# Altium schematic sheet GLOBAL.SchDoc
size A4
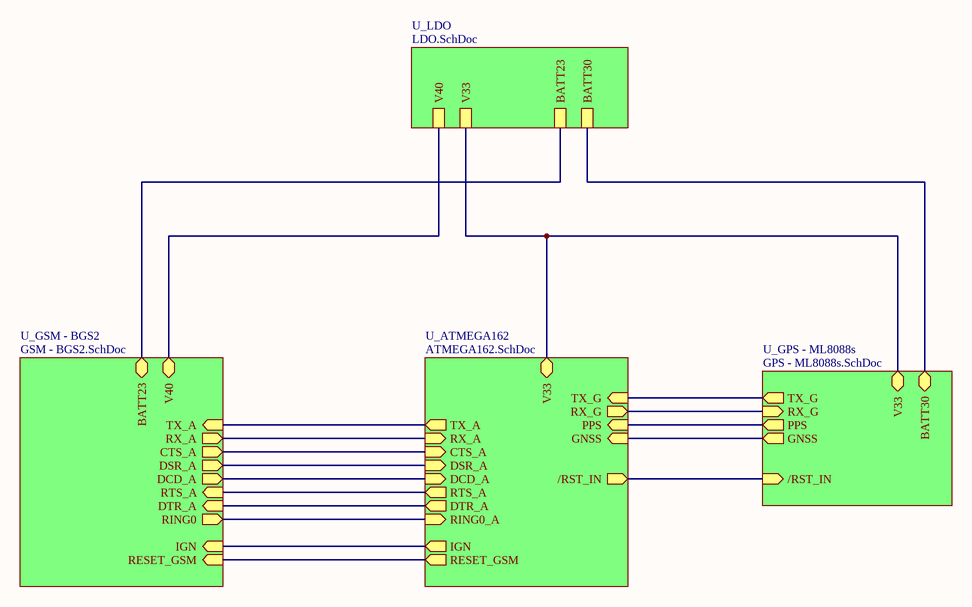
[diagram p0: GLOBAL.SchDoc]

## Sub-sheets
U_ATMEGA162 = ATMEGA162.SchDoc: RX_A (in), TX_A (out), RTS_A (out), CTS_A (in), DTR_A (out), DSR_A (in), DCD_A (in), RING0_A (in), V33 (bidir), TX_G (in), RX_G (out), GNSS (in), PPS (in), /RST_IN (out), RESET_GSM (out), IGN (out)
U_GPS - ML8088s = GPS - ML8088s.SchDoc: PPS (out), TX_G (out), RX_G (in), GNSS (out), /RST_IN (in), V33 (bidir), BATT30 (bidir)
U_GSM - BGS2 = GSM - BGS2.SchDoc: DTR_A (in), RTS_A (in), RX_A (out), TX_A (in), CTS_A (out), DSR_A (out), DCD_A (out), RING0 (out), RESET_GSM (in), V40 (bidir), IGN (in), BATT23 (bidir)
U_LDO = LDO.SchDoc: V33, V40, BATT23, BATT30

## Nets
(unnamed): sheet U_LDO/V33, sheet U_ATMEGA162/V33, sheet U_GPS - ML8088s/V33
(unnamed): sheet U_LDO/V40, sheet U_GSM - BGS2/V40
(unnamed): sheet U_LDO/BATT23, sheet U_GSM - BGS2/BATT23
(unnamed): sheet U_LDO/BATT30, sheet U_GPS - ML8088s/BATT30
(unnamed): sheet U_ATMEGA162/RX_A, sheet U_GSM - BGS2/RX_A
(unnamed): sheet U_ATMEGA162/TX_A, sheet U_GSM - BGS2/TX_A
(unnamed): sheet U_ATMEGA162/RTS_A, sheet U_GSM - BGS2/RTS_A
(unnamed): sheet U_ATMEGA162/CTS_A, sheet U_GSM - BGS2/CTS_A
(unnamed): sheet U_ATMEGA162/DTR_A, sheet U_GSM - BGS2/DTR_A
(unnamed): sheet U_ATMEGA162/DSR_A, sheet U_GSM - BGS2/DSR_A
(unnamed): sheet U_ATMEGA162/DCD_A, sheet U_GSM - BGS2/DCD_A
(unnamed): sheet U_ATMEGA162/RING0_A, sheet U_GSM - BGS2/RING0
(unnamed): sheet U_ATMEGA162/TX_G, sheet U_GPS - ML8088s/TX_G
(unnamed): sheet U_ATMEGA162/RX_G, sheet U_GPS - ML8088s/RX_G
(unnamed): sheet U_ATMEGA162/GNSS, sheet U_GPS - ML8088s/GNSS
(unnamed): sheet U_ATMEGA162/PPS, sheet U_GPS - ML8088s/PPS
(unnamed): sheet U_ATMEGA162//RST_IN, sheet U_GPS - ML8088s//RST_IN
(unnamed): sheet U_ATMEGA162/RESET_GSM, sheet U_GSM - BGS2/RESET_GSM
(unnamed): sheet U_ATMEGA162/IGN, sheet U_GSM - BGS2/IGN